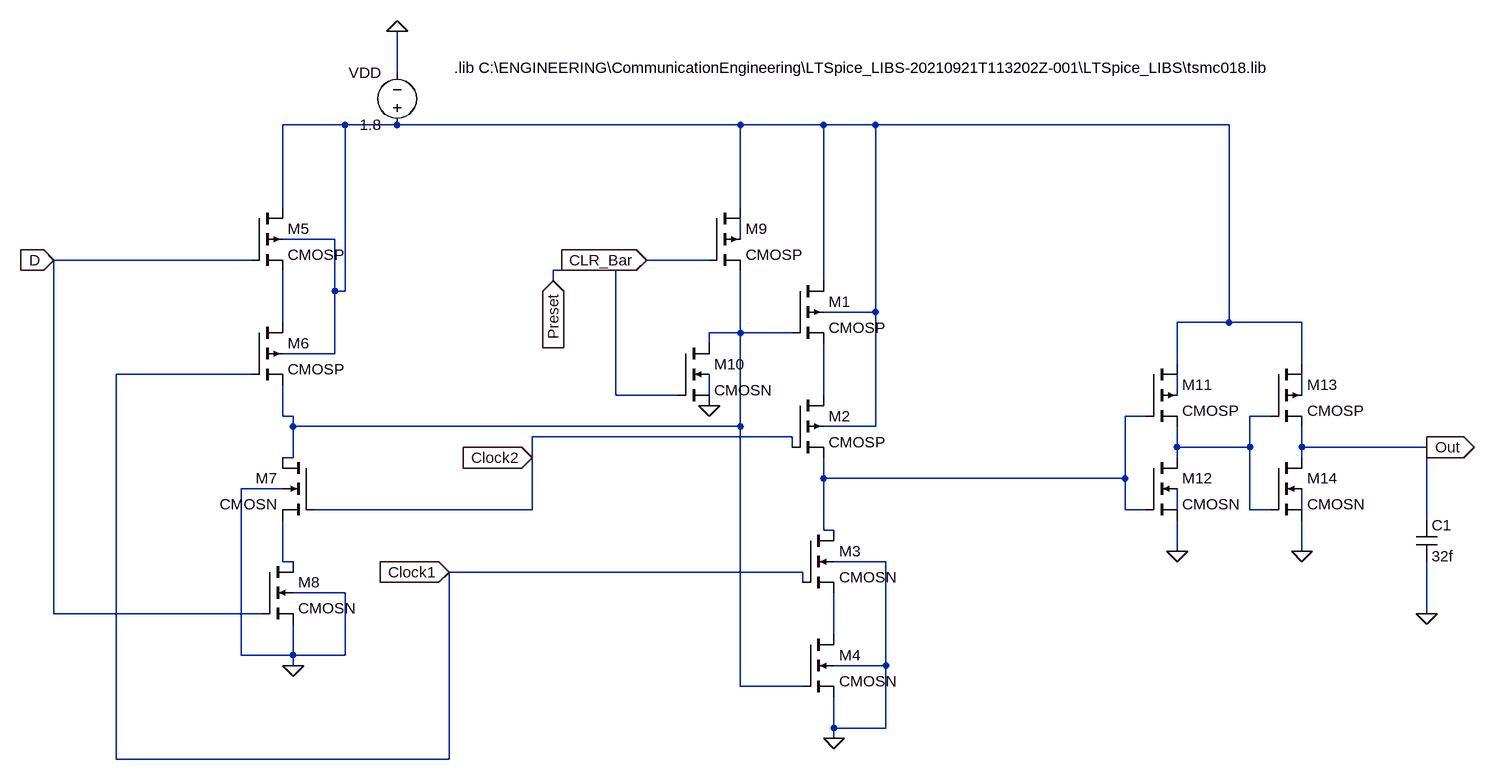
[diagram p0: schematic D_Flip_Flop_final_880_440_with_buffer.asc]
D_Flip_Flop_final_880_440_with_buffer.asc, the LTspice schematic file:
Version 4
SHEET 1 1524 1044
WIRE -160 -16 -160 -80
WIRE -240 64 -336 64
WIRE -160 64 -240 64
WIRE 368 64 -160 64
WIRE 496 64 368 64
WIRE 576 64 496 64
WIRE 1120 64 576 64
WIRE -336 192 -336 64
WIRE 368 192 368 64
WIRE -256 240 -336 240
WIRE 368 240 368 208
WIRE -384 272 -688 272
WIRE 320 272 224 272
WIRE 176 288 80 288
WIRE 80 304 80 288
WIRE 496 304 496 64
WIRE -256 320 -256 240
WIRE -240 320 -240 64
WIRE -240 320 -256 320
WIRE 576 352 576 64
WIRE 576 352 496 352
WIRE -336 368 -336 288
WIRE 1120 368 1120 64
WIRE 1120 368 1040 368
WIRE 1232 368 1120 368
WIRE 368 384 368 288
WIRE 368 384 320 384
WIRE 448 384 368 384
WIRE 320 400 320 384
WIRE -256 416 -256 320
WIRE -256 416 -336 416
WIRE 1040 432 1040 368
WIRE 1232 432 1232 368
WIRE -384 448 -592 448
WIRE 176 480 176 288
WIRE 272 480 176 480
WIRE 320 480 320 448
WIRE 496 480 496 400
WIRE 1040 480 1040 448
WIRE 1232 480 1232 448
WIRE -336 512 -336 464
WIRE -320 512 -336 512
WIRE 992 512 960 512
WIRE 1184 512 1152 512
WIRE -320 528 -320 512
WIRE 368 528 368 384
WIRE 368 528 -320 528
WIRE 576 528 576 352
WIRE 576 528 496 528
WIRE 448 544 48 544
WIRE 448 560 448 544
WIRE 1040 560 1040 528
WIRE 1152 560 1152 512
WIRE 1152 560 1040 560
WIRE 1232 560 1232 528
WIRE 1424 560 1232 560
WIRE -320 576 -320 528
WIRE -320 576 -336 576
WIRE 48 576 48 544
WIRE 1040 576 1040 560
WIRE 1232 576 1232 560
WIRE 496 608 496 576
WIRE 960 608 960 512
WIRE 960 608 496 608
WIRE -336 624 -400 624
WIRE 48 656 48 576
WIRE 48 656 -288 656
WIRE 960 656 960 608
WIRE 992 656 960 656
WIRE 1040 656 1040 624
WIRE 1152 656 1152 560
WIRE 1184 656 1152 656
WIRE 1232 656 1232 624
WIRE 1424 672 1424 560
WIRE 496 688 496 608
WIRE 512 688 496 688
WIRE 1040 720 1040 672
WIRE 1232 720 1232 672
WIRE -336 736 -336 672
WIRE -320 736 -336 736
WIRE 592 736 512 736
WIRE 464 752 -80 752
WIRE 464 768 464 752
WIRE -240 784 -320 784
WIRE -688 816 -688 272
WIRE -368 816 -688 816
WIRE 1424 816 1424 736
WIRE 512 848 512 784
WIRE -400 880 -400 624
WIRE -320 880 -320 832
WIRE -320 880 -400 880
WIRE -240 880 -240 784
WIRE -240 880 -320 880
WIRE -320 896 -320 880
WIRE 592 896 592 736
WIRE 592 896 512 896
WIRE 368 928 368 528
WIRE 464 928 368 928
WIRE 512 992 512 944
WIRE 592 992 592 896
WIRE 592 992 512 992
WIRE 512 1008 512 992
WIRE -592 1040 -592 448
WIRE -80 1040 -80 752
WIRE -80 1040 -592 1040
FLAG -160 -80 0
FLAG 512 1008 0
FLAG 1424 816 0
FLAG -320 896 0
FLAG 320 496 0
FLAG 1232 720 0
FLAG 1040 720 0
FLAG -688 272 D
IOPIN -688 272 In
FLAG -80 752 Clock1
IOPIN -80 752 In
FLAG 48 576 Clock2
IOPIN 48 576 In
FLAG 1424 560 Out
IOPIN 1424 560 Out
FLAG 80 304 Preset
IOPIN 80 304 In
FLAG 224 272 CLR_Bar
IOPIN 224 272 In
SYMBOL pmos4 448 304 R0
SYMATTR InstName M1
SYMATTR Value CMOSP
SYMATTR Value2 l=180n w=880n
SYMBOL pmos4 448 480 R0
SYMATTR InstName M2
SYMATTR Value CMOSP
SYMATTR Value2 l=180n w=880n
SYMBOL nmos4 464 688 R0
SYMATTR InstName M3
SYMATTR Value CMOSN
SYMATTR Value2 l=180n w=440n
SYMBOL nmos4 464 848 R0
SYMATTR InstName M4
SYMATTR Value CMOSN
SYMATTR Value2 l=180n w=440n
SYMBOL voltage -160 80 R180
WINDOW 0 24 96 Left 2
WINDOW 3 24 16 Left 2
SYMATTR InstName VDD
SYMATTR Value 1.8
SYMBOL cap 1408 672 R0
SYMATTR InstName C1
SYMATTR Value 32f
SYMBOL pmos4 -384 192 R0
SYMATTR InstName M5
SYMATTR Value CMOSP
SYMATTR Value2 l=180n w=880n
SYMBOL pmos4 -384 368 R0
SYMATTR InstName M6
SYMATTR Value CMOSP
SYMATTR Value2 l=180n w=880n
SYMBOL nmos4 -288 576 M0
SYMATTR InstName M7
SYMATTR Value CMOSN
SYMATTR Value2 l=180n w=440n
SYMBOL nmos4 -368 736 R0
SYMATTR InstName M8
SYMATTR Value CMOSN
SYMATTR Value2 l=180n w=440n
SYMBOL pmos4 320 192 R0
SYMATTR InstName M9
SYMATTR Value CMOSP
SYMATTR Value2 l=180n w=880n
SYMBOL nmos4 272 400 R0
SYMATTR InstName M10
SYMATTR Value CMOSN
SYMATTR Value2 l=180n w=440n
SYMBOL pmos4 992 432 R0
SYMATTR InstName M11
SYMATTR Value CMOSP
SYMATTR Value2 l=180n w=880n
SYMBOL nmos4 992 576 R0
SYMATTR InstName M12
SYMATTR Value CMOSN
SYMATTR Value2 l=180n w=440n
SYMBOL pmos4 1184 432 R0
SYMATTR InstName M13
SYMATTR Value CMOSP
SYMATTR Value2 l=180n w=880n
SYMBOL nmos4 1184 576 R0
SYMATTR InstName M14
SYMATTR Value CMOSN
SYMATTR Value2 l=180n w=440n
TEXT -72 -24 Left 2 !.lib C:\\ENGINEERING\\CommunicationEngineering\\LTSpice_LIBS-20210921T113202Z-001\\LTSpice_LIBS\\tsmc018.lib

The netlist it stands for:
* D_Flip_Flop_final_880_440_with_buffer.asc
M1 N001 N004 N006 N001 CMOSP l=180n w=880n
M2 N006 Clock2 N009 N001 CMOSP l=180n w=880n
M3 N009 Clock1 N014 0 CMOSN l=180n w=440n
M4 N014 N004 0 0 CMOSN l=180n w=440n
VDD N001 0 1.8
C1 Out 0 32f
M5 N001 D N003 N001 CMOSP l=180n w=880n
M6 N003 Clock1 N004 N001 CMOSP l=180n w=880n
M7 N004 Clock2 N013 0 CMOSN l=180n w=440n
M8 N013 D 0 0 CMOSN l=180n w=440n
M9 N001 CLR_Bar N004 N002 CMOSP l=180n w=880n
M10 N004 Preset 0 N005 CMOSN l=180n w=440n
M11 N001 N009 N010 N007 CMOSP l=180n w=880n
M12 N010 N009 0 N011 CMOSN l=180n w=440n
M13 N001 N010 Out N008 CMOSP l=180n w=880n
M14 Out N010 0 N012 CMOSN l=180n w=440n
.model NMOS NMOS
.model PMOS PMOS
.lib standard.mos
.lib C:\ENGINEERING\CommunicationEngineering\LTSpice_LIBS-20210921T113202Z-001\LTSpice_LIBS\tsmc018.lib
.backanno
.end